# EAGLE schematic mic-preamp1 (EAGLE 6.2)
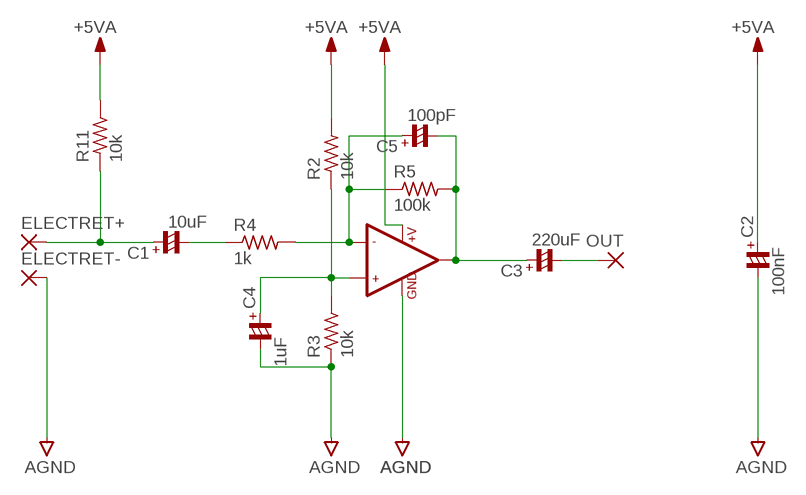
[diagram p0: schematic, sheet 1]

## Parts
C1  10uF  CPOL-USE5-4  [E5-4]
C2  100nF  CPOL-USE5-4  [E5-4]
C3  220uF  CPOL-USE5-4  [E5-4]
C4  1uF  CPOL-USE5-4  [E5-4]
C5  100pF  CPOL-USE5-4  [E5-4]
ELECTRET+  1,6/0,9  [1,6/0,9]
ELECTRET-  1,6/0,9  [1,6/0,9]
OUT  1,6/0,9  [1,6/0,9]
R2  10k  R-US_0204/5  [0204/5]
R3  10k  R-US_0204/5  [0204/5]
R4  1k  R-US_0204/5  [0204/5]
R5  100k  R-US_0204/5  [0204/5]
R11  10k  R-US_0204/5  [0204/5]
U$1  LMV358  [SO08]

## Nets
+5VA: C2.+ R2.2 R11.2 U$1.8(+V)
AGND: C2.- C4.- ELECTRET-.1(P) R3.1 U$1.4(GND)
N$1: C3.+ C5.- R5.2 U$1.1(OUT1)
N$2: C5.+ R4.2 R5.1 U$1.2(-IN1)
N$3: C4.+ R2.1 R3.2 U$1.3(+IN1)
N$4: C1.- R4.1
N$5: C1.+ ELECTRET+.1(P) R11.1
N$7: C3.- OUT.1(P)
Unconnected: U$1.5(+IN2) U$1.6(-IN2) U$1.7(OUT2)

## Library data of the parts
C1-C5 = rcl:CPOL-US: POLARIZED CAPACITOR, American symbol
ELECTRET+ ELECTRET- OUT = wirepad:1,6/0,9: THROUGH-HOLE PAD; BOM: EXCLUDE
R2-R5 R11 = rcl:R-US_: RESISTOR, American symbol
U$1 = SparkFun-AnalogIC:LMV358: Jellybean rail-to-rail output op-amp